# Altium schematic sheet Master.SchDoc
size A4; SheetNumber: 1
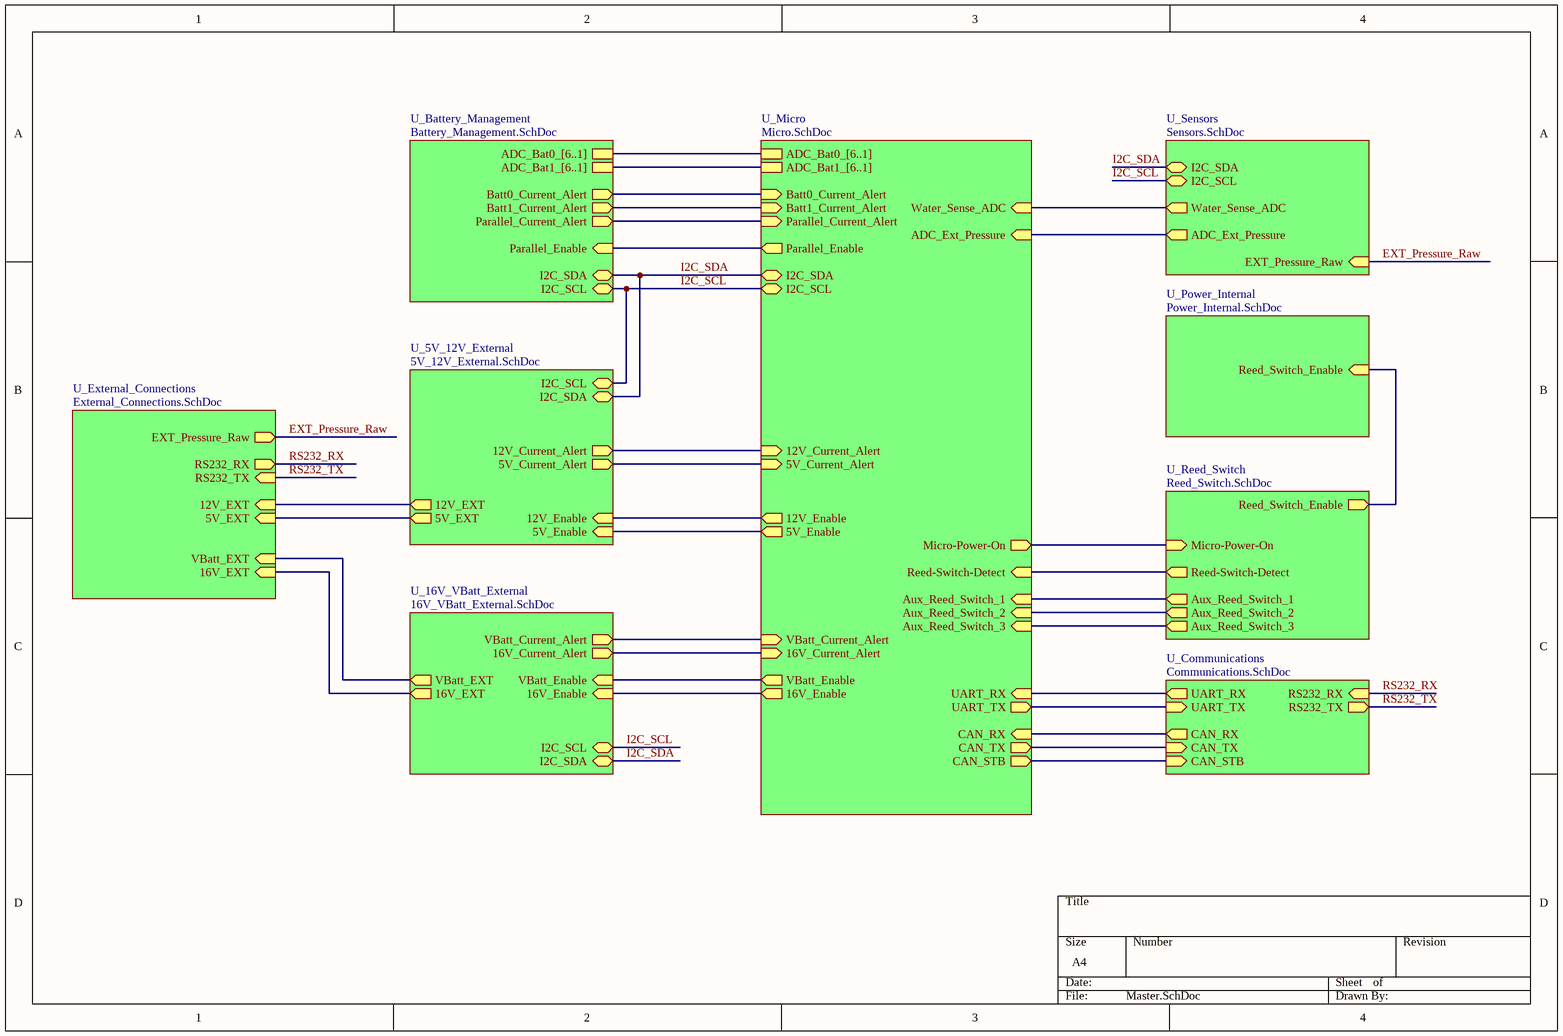
[diagram p0: Master.SchDoc]

## Sub-sheets
U_5V_12V_External = 5V_12V_External.SchDoc: 12V_Enable (in), 5V_Enable (in), I2C_SCL (bidir), I2C_SDA (bidir), 12V_Current_Alert (out), 5V_Current_Alert (out), 12V_EXT (out), 5V_EXT (out)
U_16V_VBatt_External = 16V_VBatt_External.SchDoc: VBatt_Current_Alert (out), 16V_Current_Alert (out), VBatt_Enable (in), 16V_Enable (in), I2C_SCL (bidir), I2C_SDA (bidir), VBatt_EXT (out), 16V_EXT (out)
U_Battery_Management = Battery_Management.SchDoc: Batt0_Current_Alert (out), Batt1_Current_Alert (out), Parallel_Current_Alert (out), I2C_SCL (bidir), I2C_SDA (bidir), Parallel_Enable (in), ADC_Bat1_[6..1], ADC_Bat0_[6..1]
U_Communications = Communications.SchDoc: CAN_TX (in), CAN_RX (out), UART_TX (in), UART_RX (out), RS232_RX (in), RS232_TX (out), CAN_STB (in)
U_External_Connections = External_Connections.SchDoc: 12V_EXT (in), 16V_EXT (in), 5V_EXT (in), VBatt_EXT (in), RS232_TX (in), RS232_RX (out), EXT_Pressure_Raw (out)
U_Micro = Micro.SchDoc: 12V_Current_Alert (in), 5V_Current_Alert (in), 12V_Enable (out), 5V_Enable (out), Batt0_Current_Alert (in), Batt1_Current_Alert (in), Water_Sense_ADC (in), ADC_Ext_Pressure (in), Parallel_Current_Alert (in), CAN_TX (out), CAN_RX (in), UART_RX (in), UART_TX (out), VBatt_Current_Alert (in), 16V_Current_Alert (in), VBatt_Enable (out), 16V_Enable (out), CAN_STB (out), I2C_SCL (bidir), I2C_SDA (bidir), Parallel_Enable (out), ADC_Bat1_[6..1], ADC_Bat0_[6..1], Aux_Reed_Switch_3 (in), Aux_Reed_Switch_2 (in), Aux_Reed_Switch_1 (in), Reed-Switch-Detect (in), Micro-Power-On (out)
U_Power_Internal = Power_Internal.SchDoc: Reed_Switch_Enable (in)
U_Reed_Switch = Reed_Switch.SchDoc: Reed_Switch_Enable (out), Aux_Reed_Switch_1 (out), Aux_Reed_Switch_2 (out), Aux_Reed_Switch_3 (out), Reed-Switch-Detect (out), Micro-Power-On (in)
U_Sensors = Sensors.SchDoc: I2C_SDA (bidir), Water_Sense_ADC (out), ADC_Ext_Pressure (out), I2C_SCL (bidir), EXT_Pressure_Raw (in)

## Nets
EXT_Pressure_Raw: sheet U_Sensors/EXT_Pressure_Raw, sheet U_External_Connections/EXT_Pressure_Raw
I2C_SCL: sheet U_Battery_Management/I2C_SCL, sheet U_5V_12V_External/I2C_SCL, sheet U_Micro/I2C_SCL, sheet U_Sensors/I2C_SCL, sheet U_16V_VBatt_External/I2C_SCL
I2C_SDA: sheet U_Battery_Management/I2C_SDA, sheet U_5V_12V_External/I2C_SDA, sheet U_Micro/I2C_SDA, sheet U_Sensors/I2C_SDA, sheet U_16V_VBatt_External/I2C_SDA
RS232_RX: sheet U_Communications/RS232_RX, sheet U_External_Connections/RS232_RX
RS232_TX: sheet U_Communications/RS232_TX, sheet U_External_Connections/RS232_TX
(unnamed): sheet U_Battery_Management/Batt0_Current_Alert, sheet U_Micro/Batt0_Current_Alert
(unnamed): sheet U_Battery_Management/Batt1_Current_Alert, sheet U_Micro/Batt1_Current_Alert
(unnamed): sheet U_Battery_Management/Parallel_Current_Alert, sheet U_Micro/Parallel_Current_Alert
(unnamed): sheet U_Battery_Management/Parallel_Enable, sheet U_Micro/Parallel_Enable
(unnamed): sheet U_5V_12V_External/12V_Enable, sheet U_Micro/12V_Enable
(unnamed): sheet U_5V_12V_External/5V_Enable, sheet U_Micro/5V_Enable
(unnamed): sheet U_5V_12V_External/12V_Current_Alert, sheet U_Micro/12V_Current_Alert
(unnamed): sheet U_5V_12V_External/5V_Current_Alert, sheet U_Micro/5V_Current_Alert
(unnamed): sheet U_5V_12V_External/12V_EXT, sheet U_External_Connections/12V_EXT
(unnamed): sheet U_5V_12V_External/5V_EXT, sheet U_External_Connections/5V_EXT
(unnamed): sheet U_Micro/Water_Sense_ADC, sheet U_Sensors/Water_Sense_ADC
(unnamed): sheet U_Micro/ADC_Ext_Pressure, sheet U_Sensors/ADC_Ext_Pressure
(unnamed): sheet U_Micro/CAN_TX, sheet U_Communications/CAN_TX
(unnamed): sheet U_Micro/CAN_RX, sheet U_Communications/CAN_RX
(unnamed): sheet U_Micro/UART_RX, sheet U_Communications/UART_RX
(unnamed): sheet U_Micro/UART_TX, sheet U_Communications/UART_TX
(unnamed): sheet U_Micro/VBatt_Current_Alert, sheet U_16V_VBatt_External/VBatt_Current_Alert
(unnamed): sheet U_Micro/16V_Current_Alert, sheet U_16V_VBatt_External/16V_Current_Alert
(unnamed): sheet U_Micro/VBatt_Enable, sheet U_16V_VBatt_External/VBatt_Enable
(unnamed): sheet U_Micro/16V_Enable, sheet U_16V_VBatt_External/16V_Enable
(unnamed): sheet U_Micro/CAN_STB, sheet U_Communications/CAN_STB
(unnamed): sheet U_Micro/Aux_Reed_Switch_3, sheet U_Reed_Switch/Aux_Reed_Switch_3
(unnamed): sheet U_Micro/Aux_Reed_Switch_2, sheet U_Reed_Switch/Aux_Reed_Switch_2
(unnamed): sheet U_Micro/Aux_Reed_Switch_1, sheet U_Reed_Switch/Aux_Reed_Switch_1
(unnamed): sheet U_Micro/Reed-Switch-Detect, sheet U_Reed_Switch/Reed-Switch-Detect
(unnamed): sheet U_Micro/Micro-Power-On, sheet U_Reed_Switch/Micro-Power-On
(unnamed): sheet U_Power_Internal/Reed_Switch_Enable, sheet U_Reed_Switch/Reed_Switch_Enable
(unnamed): sheet U_16V_VBatt_External/VBatt_EXT, sheet U_External_Connections/VBatt_EXT
(unnamed): sheet U_16V_VBatt_External/16V_EXT, sheet U_External_Connections/16V_EXT

## Buses and harness runs
bus sheet U_Battery_Management/ADC_Bat0_[6..1] = sheet U_Micro/ADC_Bat0_[6..1]
bus sheet U_Battery_Management/ADC_Bat1_[6..1] = sheet U_Micro/ADC_Bat1_[6..1]